# EAGLE design ac-adapter (EAGLE 9.6.2)
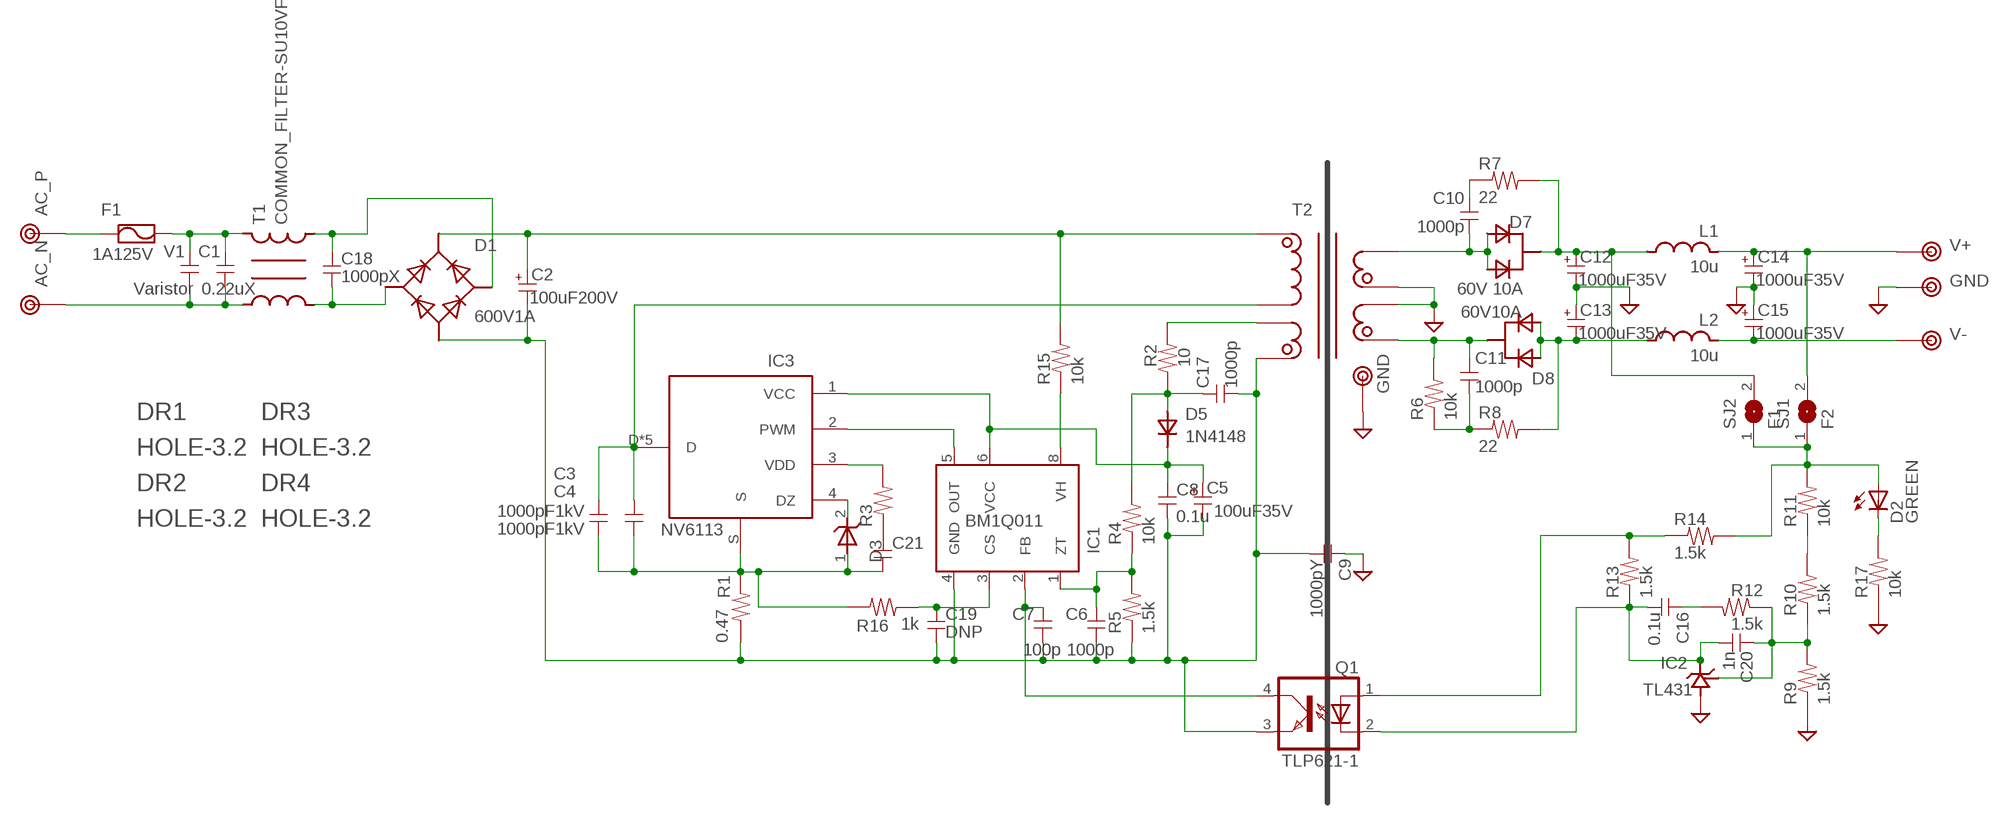
[diagram p0: schematic, sheet 1]

## Parts
C1  0.22uX  C-X  [X-CAPACITER]
C2  100uF200V  CPOLE7.5-16A2  [E5-16A2]
C3  1000pF1kV  C-5  [C050]
C4  1000pF1kV  C-5  [C050]
C5  100uF35V  CPOLE2.5-8  [E2,5-8]
C6  1000p  C-1608  [1608]
C7  100p  C-1608  [1608]
C8  0.1u  C-2012  [2012]
C9  1000pY  C-Y  [Y-CAPACITER]
C10  1000p  C-1608  [1608]
C11  1000p  C-1608  [1608]
C12  1000uF35V  CPOLE5-13  [E5-13]
C13  1000uF35V  CPOLE5-13  [E5-13]
C14  1000uF35V  CPOLE5-10  [E5-10]
C15  1000uF35V  CPOLE5-10  [E5-10]
C16  0.1u  C-1608  [1608]
C17  1000p  C-1608  [1608]
C18  1000pX  C-5  [C050]
C19  DNP  C-1608  [1608]
C20  1n  C-1608  [1608]
C21  C-1608  [1608]
D1  600V1A  DIODE4-GBU8A  [GBU8A]
D2  GREEN  LED-SMD1608  [D1608]
D3  ZENER-SMD  [SOD123]
D5  1N4148  DIODE-1N4148W  [SOD123]
D7  60V 10A  DIODE2  [TO-220]
D8  60V10A  DIODE2  [TO-220]
DR1  HOLE-3.2  [HOLE_3.2]
DR2  HOLE-3.2  [HOLE_3.2]
DR3  HOLE-3.2  [HOLE_3.2]
DR4  HOLE-3.2  [HOLE_3.2]
F1  1A125V  FUSE-5  [FUSE-5]
IC1  BM1Q011  [SOP8-J7S]
IC2  TL431  [TO-92]
IC3  NV6113  [NV6113]
L1  10u  L-5  [L5-7,5]
L2  10u  L-5  [L5-7,5]
Q1  TLP621-1  [DIL04]
R1  0.47  R-10  [0207/10]
R2  10  R-2012  [2012]
R3  R-1608  [1608]
R4  10k  R-1608  [1608]
R5  1.5k  R-1608  [1608]
R6  10k  R-1608  [1608]
R7  22  R-2012  [2012]
R8  22  R-2012  [2012]
R9  1.5k  R-1608  [1608]
R10  1.5k  R-1608  [1608]
R11  10k  R-1608  [1608]
R12  1.5k  R-1608  [1608]
R13  1.5k  R-1608  [1608]
R14  1.5k  R-1608  [1608]
R15  10k  R-2012  [2012]
R16  1k  R-1608  [1608]
R17  10k  R-1608  [1608]
SJ1  F2  SJ1608  [SJ1608]
SJ2  F1  SJ1608  [SJ1608]
T1  COMMON_FILTER-SU10VFC  [SU10VFC]
T2  TRANSFORMAER_FLYBACK-PQ2620-2  [BPQ26/20-1112CPFR]
TP1  AC_P  TESTPIN-LARGE  [TESTPIN-LARGE]
TP2  AC_N  TESTPIN-LARGE  [TESTPIN-LARGE]
TP3  V+  TESTPIN-LARGE  [TESTPIN-LARGE]
TP4  GND  TESTPIN-LARGE  [TESTPIN-LARGE]
TP5  V-  TESTPIN-LARGE  [TESTPIN-LARGE]
TP6  GND  TESTPIN-BIG  [TESTPIN-BIG]
V1  Varistor  C-5  [C050]

## Nets
GND: C9.1 C12.- C13.+ C14.- C15.+ IC2.2(GND) R9.1 R17.1 T2.9(L3_P) T2.10(L4_N) TP4.1 TP6.1
N$1: F1.1 TP1.1
N$2: C1.2 T1.1 TP2.1 V1.2
N$3: C1.1 F1.2 T1.4 V1.1
N$4: C18.2 D1.2(AC1) T1.2
N$5: IC1.8(VH) R15.1
N$6: C12.+ D7.2(K) L1.2 R7.2 SJ2.2
N$7: C6.1 IC1.1(ZT) R4.1 R5.2
N$8: C10.1 R7.1
N$9: D2.A R11.2 R14.2 SJ1.1 SJ2.1
N$10: R2.2 T2.6(L2_N)
N$11: C17.1 D5.1(A) R2.1 R4.2
N$12: C3.2 C4.2 C21.2 D3.1(A) IC3.S R1.2 R16.1
N$13: IC1.5(OUT) IC3.2(PWM)
N$14: C21.1 R3.1
N$15: C19.1 IC1.3(CS) R16.2
N$16: C18.1 D1.3(AC2) T1.3
N$17: C10.2 D7.1(A1) D7.3(A2) T2.7(L3_N) T2.8(L3_N)
N$18: C11.1 D8.2(K) R6.2 T2.11(L4_P) T2.12(L4_P)
N$19: C7.1 IC1.2(FB) Q1.4(COL)
N$20: IC3.3(VDD) R3.2
N$21: D2.K R17.2
N$22: C11.2 R6.1 R8.1
N$23: C13.- D8.1(A1) D8.3(A2) L2.2 R8.2
N$24: D3.2(C) IC3.4(DZ)
N$25: R10.2 R11.1
N$26: C20.1 IC2.1(REF) R9.2 R10.1 R12.1
N$27: C16.1 R12.2
N$28: C16.2 C20.2 IC2.3(OUT) Q1.2(C) R13.1
N$29: Q1.1(A) R13.2 R14.1
PGND: C2.- C5.- C6.2 C7.2 C8.2 C9.2 C17.2 C19.2 D1.4(V-) IC1.4(GND) Q1.3(EMIT) R1.1 R5.1 T2.5(L2_P)
SW: C3.1 C4.1 IC3.D IC3.D1(D) IC3.D2(D) IC3.D3(D) IC3.D4(D) T2.1(L1_N)
V+: C14.+ L1.1 SJ1.2 TP3.1
V-: C15.- L2.1 TP5.1
VCC: C5.+ C8.1 D5.2(K) IC1.6(VCC) IC3.1(VCC)
VP: C2.+ D1.1(V+) R15.2 T2.3(L1_P)

## Library data of the parts
C1 C3 C4 C6-C11 C16-C21 V1 = my_rcl:C
C2 C5 C12-C15 = my_rcl:CPOL
D1 = my_rcl:DIODE4
D2 = my_rcl:LED
D3 = my_rcl:ZENER
D5 = my_rcl:DIODE
D7 D8 = my_rcl:DIODE2
DR1-DR4 = my_connector:HOLE-3.2
F1 = my_rcl:FUSE
IC1 = my_ic:BM1Q011
IC2 = my_ic:TL431
IC3 = my_ic:NV6113
L1 L2 = my_rcl:L
Q1 = my_ic:TLP621-1: Photocoupler
R1-R17 = my_rcl:R
SJ1 SJ2 = Connector_Robotech:SJ: SMD solder JUMPER
T1 = my_rcl:COMMON_FILTER
T2 = my_rcl:TRANSFORMAER_FLYBACK
TP1-TP6 = my_connector:TESTPIN

## Board
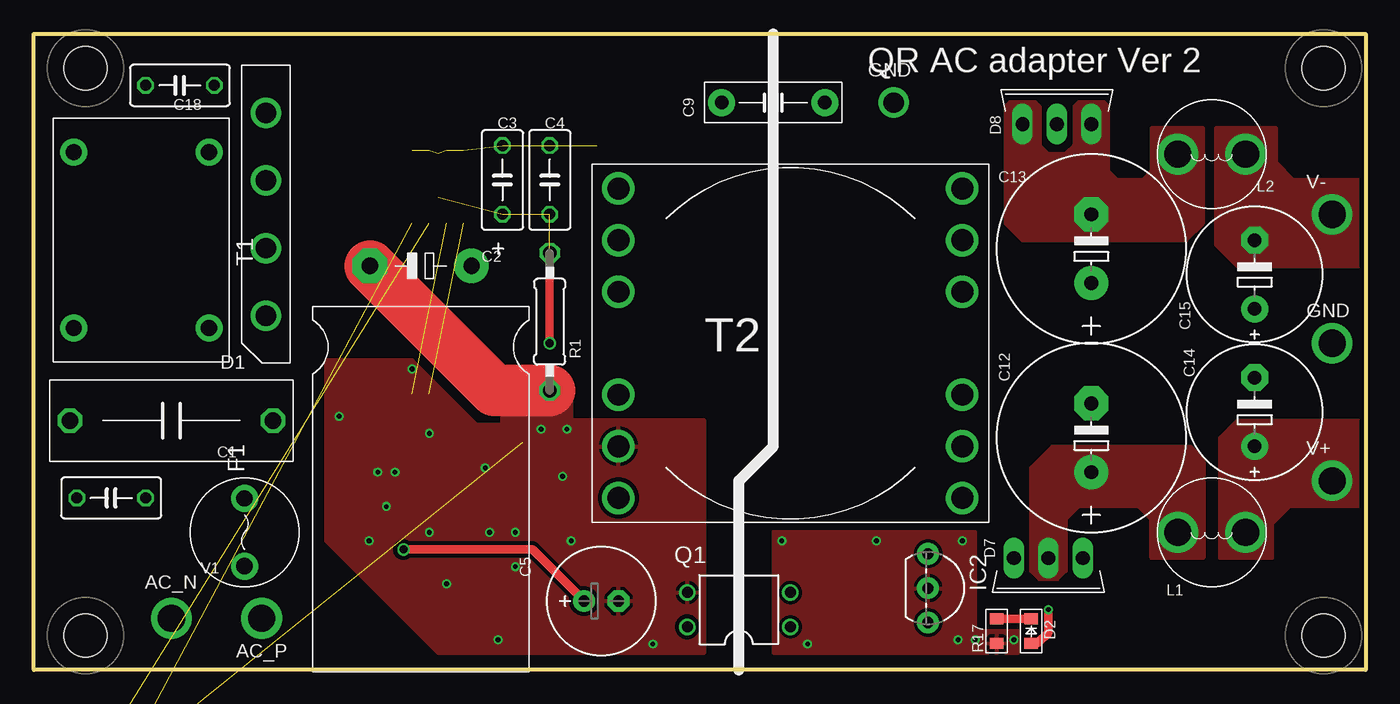
[diagram p1: board, top side]
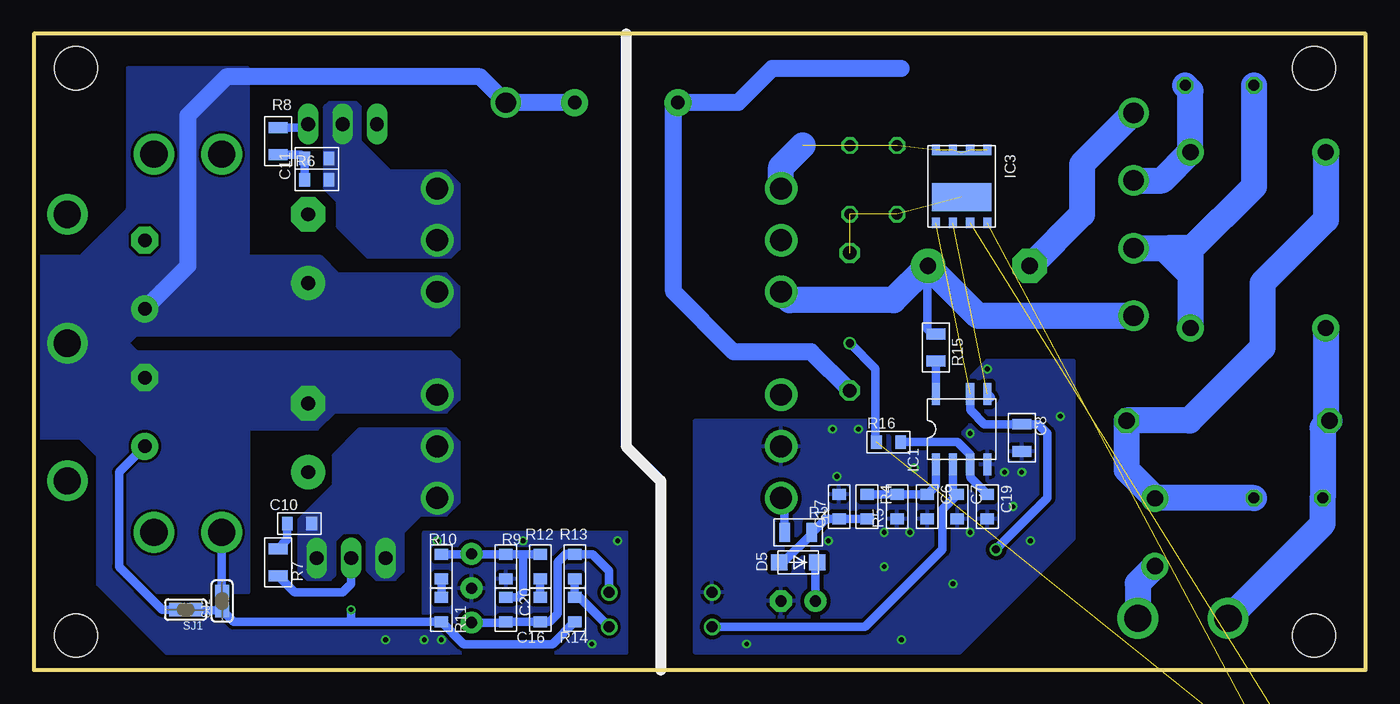
[diagram p2: board, bottom side, seen from below]

Size 98.36 x 46.99 mm. Coordinates in mm from the lower left corner, seen from the top.
Outline: 0,0 0,46.99 98.36,46.99 98.36,0 0,0
Copper layers (1*16): Top 0.035mm / dielectric 1.5mm / Bottom 0.035mm
Design rules "SeeedStudio_2layer_DRU_20140221 *": minimum track width 6mil, minimum drill 0.3mm, track to track 8mil, track to pad 8mil, pad to pad 8mil, via to via 12mil, smd to smd 0mil, copper to edge 0.3mm, drill to drill 10mil, minimum pad ring 0.15mm, minimum via ring 6mil, stop-mask expansion 2mil, vias tented up to drill 1mm, thermal gap 10mil

### Footprints (pad centres in the part's own frame; a part is rotated, then mirrored left to right if it is on the bottom)
X-CAPACITER = drill 1.2 octagon: 1 -7.5,0; 2 7.5,0
E5-16A2 = drill 1.2 pad 2.54: + 3.75,0 | drill 1.2 pad 2.54 octagon: - -3.75,0
C050 = drill 0.813 octagon: 1 -2.54,0; 2 2.54,0
E2,5-8 = drill 0.813 pad 1.6: + -1.27,0 | drill 0.813 pad 1.6 octagon: - 1.27,0
1608 = smd 0.8 x 1: 1 -0.9,0; 2 0.9,0
2012 = smd 0.8 x 1.4: 1 -1,0; 2 1,0
Y-CAPACITER = drill 1 pad 2: 1 -3.81,0; 2 3.81,0
E5-13 = drill 1.016 pad 2.54: + -2.54,0 | drill 1.016 pad 2.54 octagon: - 2.54,0
E5-10 = drill 1 pad 2: + -2.54,0 | drill 1 pad 2 octagon: - 2.54,0
GBU8A = drill 1.5: 1 -7.5,0; 2 -2.5,0; 3 2.5,0; 4 7.5,0
D1608 = smd 0.8 x 1: A 0.9,0; K -0.9,0
SOD123 = smd 1.2 x 1.2: 1 -1.4,0; 2 1.4,0
TO-220 = drill 1.016 long: 1 -2.54,0; 2 0,0; 3 2.54,0
HOLE_3.2 = hole 3.2: 0,0
FUSE-5 = drill 1.2 pad 2: 1 -2.5,0; 2 2.5,0
SOP8-J7S = smd 0.6 x 1.6: 1 -1.905,-2.6; 2 -0.635,-2.6; 3 0.635,-2.6; 4 1.905,-2.6; 5 1.905,2.6; 6 0.635,2.6; 8 -1.905,2.6
TO-92 = drill 0.813 pad 1.6: 1 -2.54,0; 2 0,0; 3 2.54,0
NV6113 = smd 0.6 x 0.775: 1 1.905,1.9; 2 0.635,1.9; 3 -0.635,1.9; 4 -1.905,1.9; D1 -1.905,-3.487; D2 -0.635,-3.487; D3 0.635,-3.487; D4 1.905,-3.487 | smd 4.4 x 0.3: D 0,-3.25 | smd 4.4 x 2.1: S 0,0
L5-7,5 = drill 2 pad 3: 1 -2.5,0; 2 2.5,0
DIL04 = drill 0.813: 1 -1.27,-3.81; 2 1.27,-3.81; 3 1.27,3.81; 4 -1.27,3.81
0207/10 = drill 1 octagon: 1 -5.08,0; 2 5.08,0
SJ1608 = smd 1.016 x 1.016: 1 -0.697,0; 2 0.697,0
SU10VFC = drill 1.2 pad 2: 1 -6.5,5; 2 -6.5,-5; 3 6.5,-5; 4 6.5,5
BPQ26/20-1112CPFR = drill 1.6 pad 2.4: 1 -12.7,11.43; 2 -12.7,7.62; 3 -12.7,3.81; 4 -12.7,-3.81; 5 -12.7,-7.62; 6 -12.7,-11.43; 7 12.7,-11.43; 8 12.7,-7.62; 9 12.7,-3.81; 10 12.7,3.81; 11 12.7,7.62; 12 12.7,11.43
TESTPIN-LARGE = drill 2: 1 0,0
TESTPIN-BIG = drill 1.5: 1 0,0

### Placement (x,y rotation side)
C1  10.16,18.41 180 top
C2  28.57,29.84 0 top
C3  34.61,36.2 270 top
C4  38.1,36.2 270 top
C5  41.91,5.08 0 top
C6  32.38,12.06 270 bottom
C7  30.16,12.06 270 bottom
C8  25.4,17.14 270 bottom
C9  54.61,41.91 180 top
C10  78.74,10.79 0 bottom
C11  77.47,37.78 180 bottom
C12  78.11,17.14 90 top
C13  78.11,31.11 90 top
C14  90.17,19.05 90 top
C15  90.17,29.21 90 top
C16  60.96,4.45 270 bottom
C17  38.89,12.06 90 bottom
C18  10.79,43.18 180 top
C19  27.94,12.06 270 bottom
C20  63.5,4.45 270 bottom
C21  -3.49,-14.29 0 top  (outside the outline)
D1  17.14,33.66 90 top
D2  73.66,2.86 270 top
D3  -3.49,-23.18 0 top  (outside the outline)
D5  41.91,7.94 0 bottom
D7  74.93,8.26 180 top
D8  75.56,40.32 0 top
DR1  3.81,2.54 0 top
DR2  3.81,44.45 0 top
DR3  95.25,2.54 0 top
DR4  95.25,44.45 0 top
F1  15.56,10.16 90 top
IC1  29.84,17.78 0 bottom
IC2  66.04,6.03 270 top
IC3  29.84,34.92 180 bottom
L1  87,10.16 180 top
L2  87,38.1 180 top
Q1  52.07,4.45 90 top
R1  38.1,25.72 90 top
R2  41.91,10.16 180 bottom
R3  -3.49,-18.1 0 top  (outside the outline)
R4  36.83,12.06 270 bottom
R5  34.61,12.06 90 bottom
R6  77.47,36.2 0 bottom
R7  80.33,7.94 270 bottom
R8  80.33,39.05 90 bottom
R9  63.5,7.62 90 bottom
R10  68.26,7.62 270 bottom
R11  68.26,4.45 270 bottom
R12  60.96,7.62 270 bottom
R13  58.42,7.62 270 bottom
R14  58.42,4.45 270 bottom
R15  31.75,23.81 90 bottom
R16  35.24,16.83 0 bottom
R17  71.12,2.86 90 top
SJ1  87.15,4.45 180 bottom
SJ2  84.45,5.08 90 bottom
T1  7.94,31.75 90 top
T2  55.88,24.13 0 top
TP1  16.83,3.81 180 top
TP2  10.16,3.81 180 top
TP3  95.89,13.97 0 top
TP4  95.89,24.13 0 top
TP5  95.89,33.66 0 top
TP6  63.5,41.91 0 top
V1  5.71,12.7 180 top

### Tracks (layer width: path | path; a pad name or v marks a point on that pad's centre or on a via)
GND  (via drill 0.35)
  Bottom 1.27: C15.+ 87,29.84 87,40.96 84.14,43.81 65.41,43.81 TP6.1 C9.1
  other vias: 69.53,2.22 68.26,2.22 72.39,2.22 55.24,9.53 57.15,1.91 68.58,9.53 62.23,9.53
  pour Bottom (isolate 0.025, no thermals): 83.82,24.77 67.63,24.77 66.99,25.4 66.99,28.26 67.94,29.21 75.88,29.21 77.15,30.48 83.82,30.48
  pour Bottom (isolate 0.025, no thermals): 83.82,23.5 67.63,23.5 66.99,22.86 66.99,20 67.94,19.05 76.2,19.05 77.47,17.78 83.82,17.78
  pour Bottom (isolate 0.025, no thermals): 82.55,24.77 82.55,44.45 91.44,44.45 91.44,33.97 94.93,30.48 98.11,30.48 98.11,24.13 91.44,24.13 90.81,24.77
  pour Bottom (isolate 0.025, no thermals): 98.42,24.13 91.44,24.13 90.81,23.5 82.55,23.5 82.55,5.71 92.71,5.71 92.71,14.92 94.93,17.14 98.42,17.14
  pour Top (isolate 0.254): 54.61,10.16 54.61,1.27 69.53,1.27 69.53,10.16
  pour Bottom (isolate 0.254): 54.61,10.16 54.61,1.27 69.53,1.27 69.53,10.16
  pour Bottom (isolate 0.254): 88.58,1.27 67.63,1.27 67.63,4.45 88.9,4.45 92.39,7.94 92.39,16.51 93.66,16.51 93.66,6.35
  pour Top (isolate 0.254): 69.53,2.86 69.53,1.27 72.71,1.27 72.71,2.86
N$1
  Bottom 1.905: F1.1 16.83,6.39 TP1.1
N$2
  Bottom 1.905: T1.1 2.94,18.69 C1.2 3.17,17.9 V1.2 3.17,10.79 TP2.1
N$3
  Bottom 1.905: T1.4 2.94,33.26 7.62,28.57 7.62,23.81 13.02,18.41 C1.1 17.66,14.8 15.56,12.7 | F1.2 15.56,12.7 | V1.1 15.56,12.7
N$4
  Bottom 1.905: D1.2 14.61,31.16 | 14.61,31.16 13.06,31.16 12.94,31.04 | 12.94,31.04 12.94,29.21 | 12.94,29.21 T1.2 | 12.94,31.04 8.26,35.72 C18.2 | 14.61,31.16 14.61,30.88 12.94,29.21
N$5
  Bottom 0.61: R15.1 IC1.8
N$6
  Bottom 0.61: L1.2 84.5,5.82 SJ2.2 | D7.2 74.93,6.35 75.56,5.71 79.11,5.71 R7.2
  pour Top (isolate 0.305, no thermals): 75.56,6.67 74.3,6.67 73.66,7.3 73.66,14.92 75.25,16.51 85.41,16.51 86.36,15.56 86.36,8.26 82.55,8.26 82.55,11.11 81.6,12.06 77.15,12.06 76.2,11.11 76.2,7.3
N$7
  Bottom 0.61: R4.1 R5.2 C6.1 31.75,13.6 IC1.1
N$8
  Bottom 0.61: C10.1 79.64,9.62 R7.1
N$9  (via drill 0.35)
  Top 0.61: D2.A 74.14,1.96 74.93,2.75 v74.93,4.45
  Bottom 0.61: R14.2 60.06,1.91 66.62,1.91 R11.2 74.93,3.54 | 74.93,3.54 83.62,3.54 SJ2.1 86.39,4.38 SJ1.1 | v74.93,4.45 74.93,3.54
N$10
  Bottom 0.61: T2.6 42.91,12.43 R2.2
N$11
  Bottom 0.61: R4.2 C17.1 39.85,11.16 40.85,10.16 R2.1 40.91,10.05 43.02,7.94 D5.1
N$12  (via drill 0.6)  (5 unrouted)
  Top 0.61: R1.2 v38.1,24.13
  Bottom 0.61: R16.1 36.2,16.88 36.2,22.23 v38.1,24.13
N$13  (1 unrouted)
  Bottom 0.61: IC1.5 27.67,20.11
N$14  (1 unrouted)
N$15
  Bottom 0.61: R16.2 30.16,16.83 29.21,15.88 IC1.3 29.21,14.23 C19.1
N$16
  Bottom 1.905: D1.3 15.03,36.16 T1.3 12.94,42.78 C18.1
N$17
  pour Bottom (isolate 0.025, no thermals): 74.3,17.78 67.94,17.78 66.99,16.83 66.99,12.38 67.94,11.43 69.85,11.43 71.12,10.16 71.12,7.3 71.75,6.67 73.03,6.67 73.66,7.3 73.66,9.53 74.3,10.16 75.56,10.16 76.2,9.53 76.2,6.99 76.52,6.67 78.11,6.67 78.74,7.3 78.74,11.11 76.2,13.65 76.2,15.88
N$18
  pour Bottom (isolate 0.254, no thermals): 74.3,41.59 74.3,39.05 72.07,36.83 67.94,36.83 66.99,35.88 66.99,31.11 67.63,30.48 73.66,30.48 75.88,32.7 75.88,34.61 76.83,35.56 76.83,41.59 76.52,41.91 74.61,41.91
N$19
  Bottom 0.61: IC1.2 30.48,13.02 30.43,12.96 C7.1 31.27,11.85 31.27,8.89 36.99,3.17 Q1.4
N$20  (1 unrouted)
N$21
  Top 0.61: R17.2 D2.K
N$22
  Bottom 0.61: R6.1 C11.2 78.64,38.05 R8.1
N$23
  Bottom 0.61: R8.2 78.38,40.05 D8.3
  pour Top (isolate 0.254, no thermals): 81.92,36.2 80.01,36.2 79.38,36.83 79.38,41.59 79.06,41.91 77.15,41.91 76.83,41.59 76.83,38.73 76.2,38.1 74.93,38.1 74.3,38.73 74.3,41.59 73.98,41.91 72.07,41.91 71.75,41.59 71.75,33.02 73.03,31.75 85.09,31.75 86.36,33.02 86.36,40.01 82.55,40.01 82.55,36.83
N$24  (1 unrouted)
N$25
  Bottom 0.61: R10.2 R11.1
N$26
  Bottom 0.61: R10.1 66.09,8.52 IC2.1 65.99,8.52 R9.2 62.23,8.52 | 62.23,8.52 R12.1 | C20.1 62.6,5.34 62.23,5.71 62.23,8.52
N$27
  Bottom 0.61: R12.2 C16.1
N$28
  Bottom 0.61: IC2.3 63.55,3.49 C20.2 C16.2 60.27,3.54 59.69,4.13 59.69,7.94 59.05,8.57 58.47,8.57 R13.1 57.1,8.52 55.88,7.3 Q1.2
N$29
  Bottom 0.61: Q1.1 58.05,5.34 R14.1 R13.2
PGND  (via drill 0.35)
  Top 3.81: R1.1 34.03,20.64 C2.-
  Bottom 1.27: R1.1 40.96,23.5 46.67,23.5 51.12,27.94 51.12,41.59 C9.2 46.35,41.91 43.81,44.45 34.29,44.45
  Bottom 1.905: D1.4 20.95,37.34 20.95,33.66 24.77,29.84 C2.-
  other vias: 45.72,1.91 34.29,2.22 30.48,6.35 29.21,10.16 33.66,10.16 25.4,14.61 26.67,14.61 29.21,17.46 22.54,18.73 27.94,22.23 33.34,14.92 37.47,17.78 39.05,14.29 35.56,10.16 35.56,7.62 39.37,17.78 24.77,9.53 26.04,12.06 39.69,9.53
  pour Bottom (isolate 0.305): 21.59,22.86 21.59,9.68 30,1.27 49.53,1.27 49.53,18.41 36.35,18.41 35.08,17.14 30.16,17.14 29.21,18.1 29.21,21.59 27.94,22.86
  pour Top (isolate 0.305): 21.59,22.86 21.59,9.53 29.84,1.27 49.53,1.27 49.53,18.41 37.15,18.41 36.83,18.1 32.7,18.1 27.94,22.86
  pour Top (isolate 0.305): 39.69,20.95 39.69,17.46 34.61,17.46 34.61,20.95
SW  (7 unrouted)
  Bottom 1.905: T2.1 43.18,37.15 41.59,38.73
V+
  Bottom 0.61: C14.+ 92.08,14.61 92.08,7.62 88.9,4.45 SJ1.2
  pour Top (isolate 0.305, no thermals): 91.44,8.26 87.63,8.26 87.63,17.14 88.9,18.41 98.42,18.41 98.42,12.06 92.71,12.06 91.44,10.79
V-
  pour Top (isolate 0.305, no thermals): 87.31,40.01 87.31,31.43 88.9,29.84 98.11,29.84 98.11,36.2 93.03,36.2 91.76,37.47 91.76,40.01
VCC  (via drill 0.6)  (1 unrouted)
  Top 0.61: v27.3,8.89 36.83,8.89 C5.+
  Bottom 0.61: IC1.6 29.21,19.21 28.15,18.14 C8.1 24.18,18.14 23.5,17.46 23.5,12.7 v27.3,8.89 | D5.2 40.64,7.81 C5.+
VP
  Bottom 0.61: R15.2 32.07,24.81 32.38,25.13 32.38,29.79 C2.+
  Bottom 1.905: D1.1 28.64,26.16 C2.+ 34.87,27.3 42.55,27.3 T2.3

### Text on the board
tPlace: QR AC adapter Ver 2